# EAGLE design transmitter (EAGLE 9.1.2)
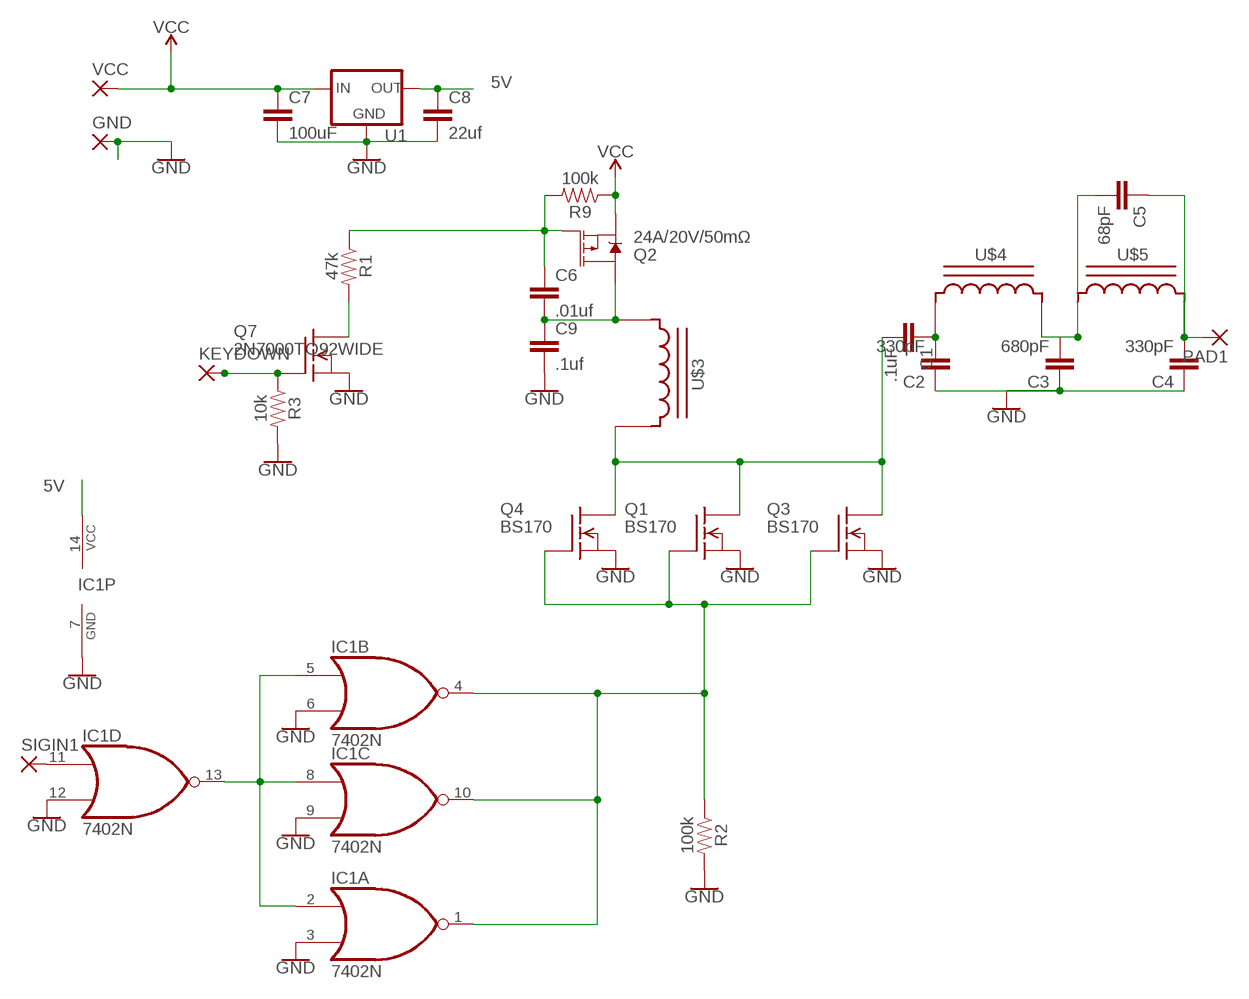
[diagram p0: schematic, sheet 1]

## Parts
C1  .1uF  C5/3.5  [C5B3.5]
C2  330pF  C5/3.5  [C5B3.5]
C3  680pF  C5/3.5  [C5B3.5]
C4  330pF  C5/3.5  [C5B3.5]
C5  68pF  C5/3.5  [C5B3.5]
C6  .01uf  C5/3.5  [C5B3.5]
C7  100uF  C5/3.5  [C5B3.5]
C8  22uf  C5/3.5  [C5B3.5]
C9  .1uf  C5/3.5  [C5B3.5]
GND  3,17/1,1  [3,17/1,1]
IC1  7402N  [DIL14]
KEYDOWN  3,17/1,1  [3,17/1,1]
PAD1  3,17/1,1  [3,17/1,1]
Q1  BS170  [TO92]
Q2  24A/20V/50mΩ  MOSFET_PCH-NDP6020P  [TO220V]
Q3  BS170  [TO92]
Q4  BS170  [TO92]
Q7  2N7000TO92WIDE  [TO92]
R1  47k  1KOHM-HORIZ-1/4W-1%  [AXIAL-0.3]
R2  100k  1KOHM-HORIZ-1/4W-1%  [AXIAL-0.3]
R3  10k  1KOHM-HORIZ-1/4W-1%  [AXIAL-0.3]
R9  100k  1KOHM-HORIZ-1/4W-1%  [AXIAL-0.3]
SIGIN1  3,17/1,1  [3,17/1,1]
U1  V_REG_78XXTO-92_UNTESTED  [TO-92]
U$3  T50_INDUCTOR  [T50_INDUCTOR]
U$4  T37_INDUCTOR  [T37_INDUCTOR]
U$5  T37_INDUCTOR  [T37_INDUCTOR]
VCC  3,17/1,1  [3,17/1,1]

## Nets
5V: C8.1 IC1.14(P:VCC) U1.1(OUT)
GND: C2.1 C3.1 C4.1 C7.2 C8.2 C9.2 GND.1(P) IC1.3(A:I1) IC1.6(B:I1) IC1.7(P:GND) IC1.9(C:I1) IC1.12(D:I1) Q1.1(S) Q3.1(S) Q4.1(S) Q7.1(S) R2.P$2 R3.P$2 U1.2(GND)
N$1: C1.1 C2.2 U$4.CB
N$2: C1.2 Q1.3(D) Q3.3(D) Q4.3(D) U$3.CA
N$3: C6.2 C9.1 Q2.2(D) U$3.CB
N$4: C6.1 Q2.1(G) R1.P$1 R9.P$2
N$5: Q7.3(D) R1.P$2
N$6: IC1.2(A:I0) IC1.5(B:I0) IC1.8(C:I0) IC1.13(D:O)
N$7: KEYDOWN.1(P) Q7.2(G) R3.P$1
N$8: IC1.1(A:O) IC1.4(B:O) IC1.10(C:O) Q1.2(G) Q3.2(G) Q4.2(G) R2.P$1
N$9: IC1.11(D:I0) SIGIN1.1(P)
N$10: C3.2 C5.2 U$4.CA U$5.CB
N$11: C4.2 C5.1 PAD1.1(P) U$5.CA
VCC: C7.1 Q2.3(S) R9.P$1 U1.3(IN) VCC.1(P)

## Library data of the parts
C1-C9 = capacitor-wima:C: CAPACITOR naming: grid - package width
GND KEYDOWN PAD1 SIGIN1 VCC = wirepad:3,17/1,1: THROUGH-HOLE PAD
IC1 = 74xx-us:74*02: Quad 2-input NOR gate
Q1 Q3 Q4 = transistor-fet+irf7201:BS170: N-Channel Enhancement MOSFET 200V; 0,16A; 11Ohm
Q2 = SparkFun-DiscreteSemi:MOSFET_PCH: P-channel MOSFETs Voltage controlled devices that allow control of high current outputs. SparkFun Products: SparkFun ESP32 Thing <https://www.sparkfun.com/products/13907> SparkFun ESP8266 Thing <https://www.sparkfun.com/products/13231>; PROD_ID: TRANS-13060
Q7 = transistor-fet+irf7201:2N7000: N-Channel Enhancement MOSFET 20V; 4A; 0,75Ohm
R1-R3 R9 = SparkFun-Resistors:1KOHM: 1kΩ resistor A resistor is a passive two-terminal electrical component that implements electrical resistance as a circuit element. Resistors act to reduce current flow, and, at the same time, act to lower voltage levels within circuits. - Wikipedia; PROD_ID: RES-12182; VALUE: 1k
U1 = SparkFun-IC-Power:V_REG_78XX: Voltage Regulator Standard 78xx regulator. IGO (Input Ground Output). Spark Fun Electronics SKU : COM-00107
U$3 = toroid:T50_INDUCTOR: Inductor wound on a T50 Core
U$4 U$5 = toroid:T37_INDUCTOR: Inductor wound on a T37 Toroid

## Net classes
0 default: width 0.762 mm, drill 0.762 mm, clearance 0.508 mm

## Board
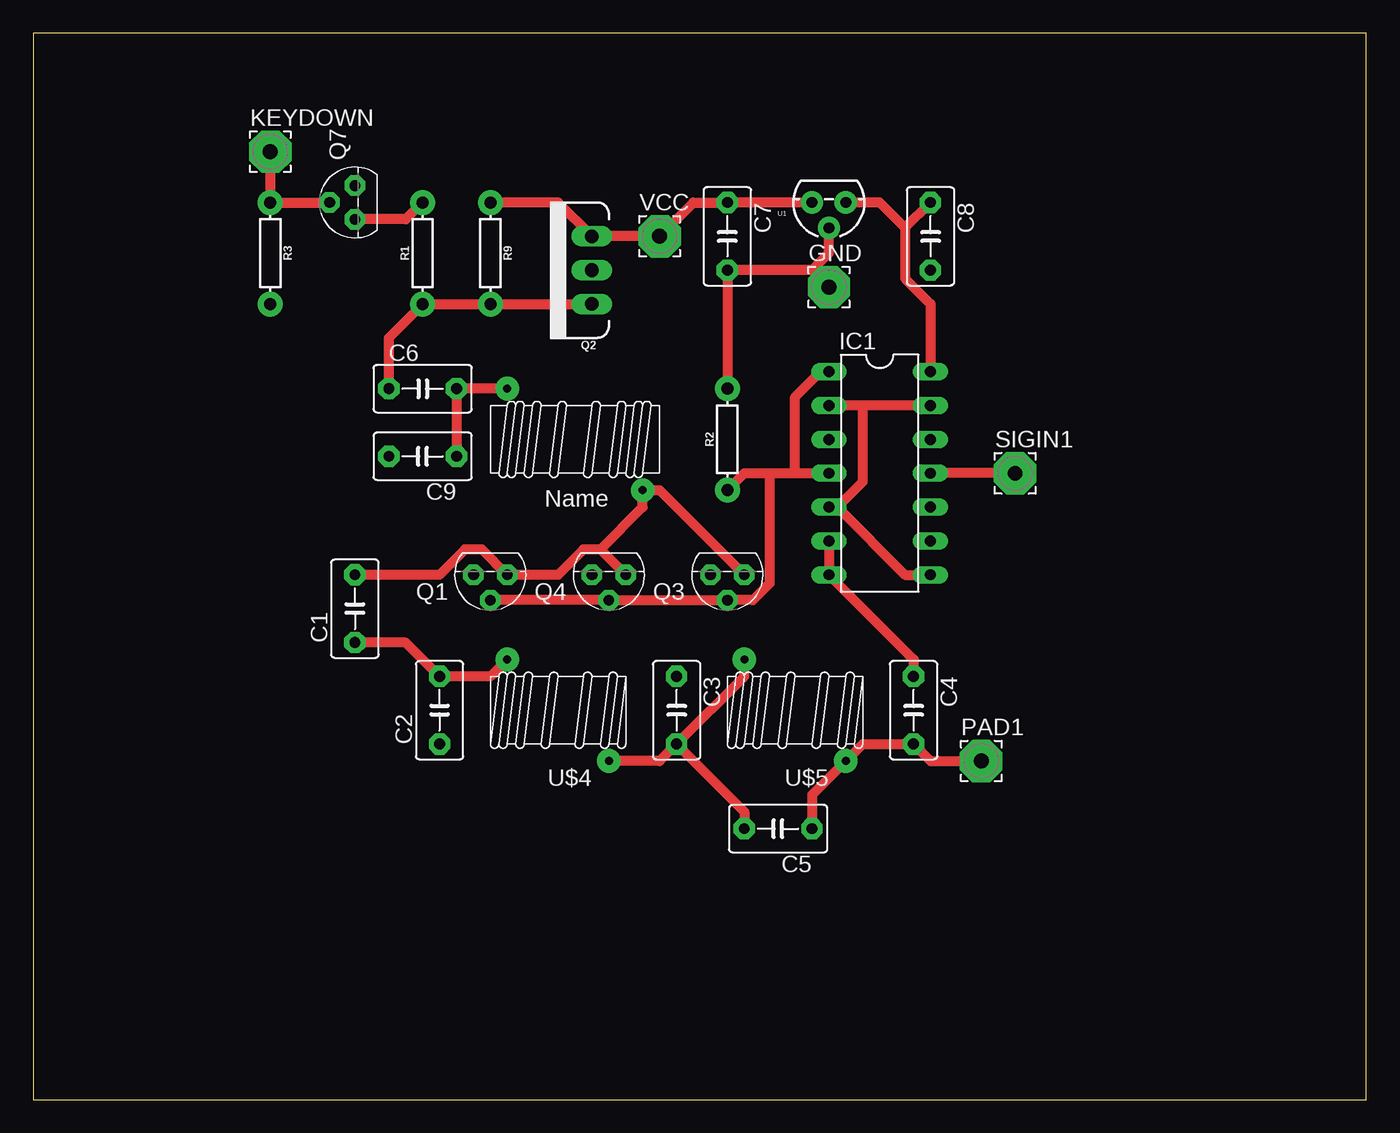
[diagram p1: board, top side]
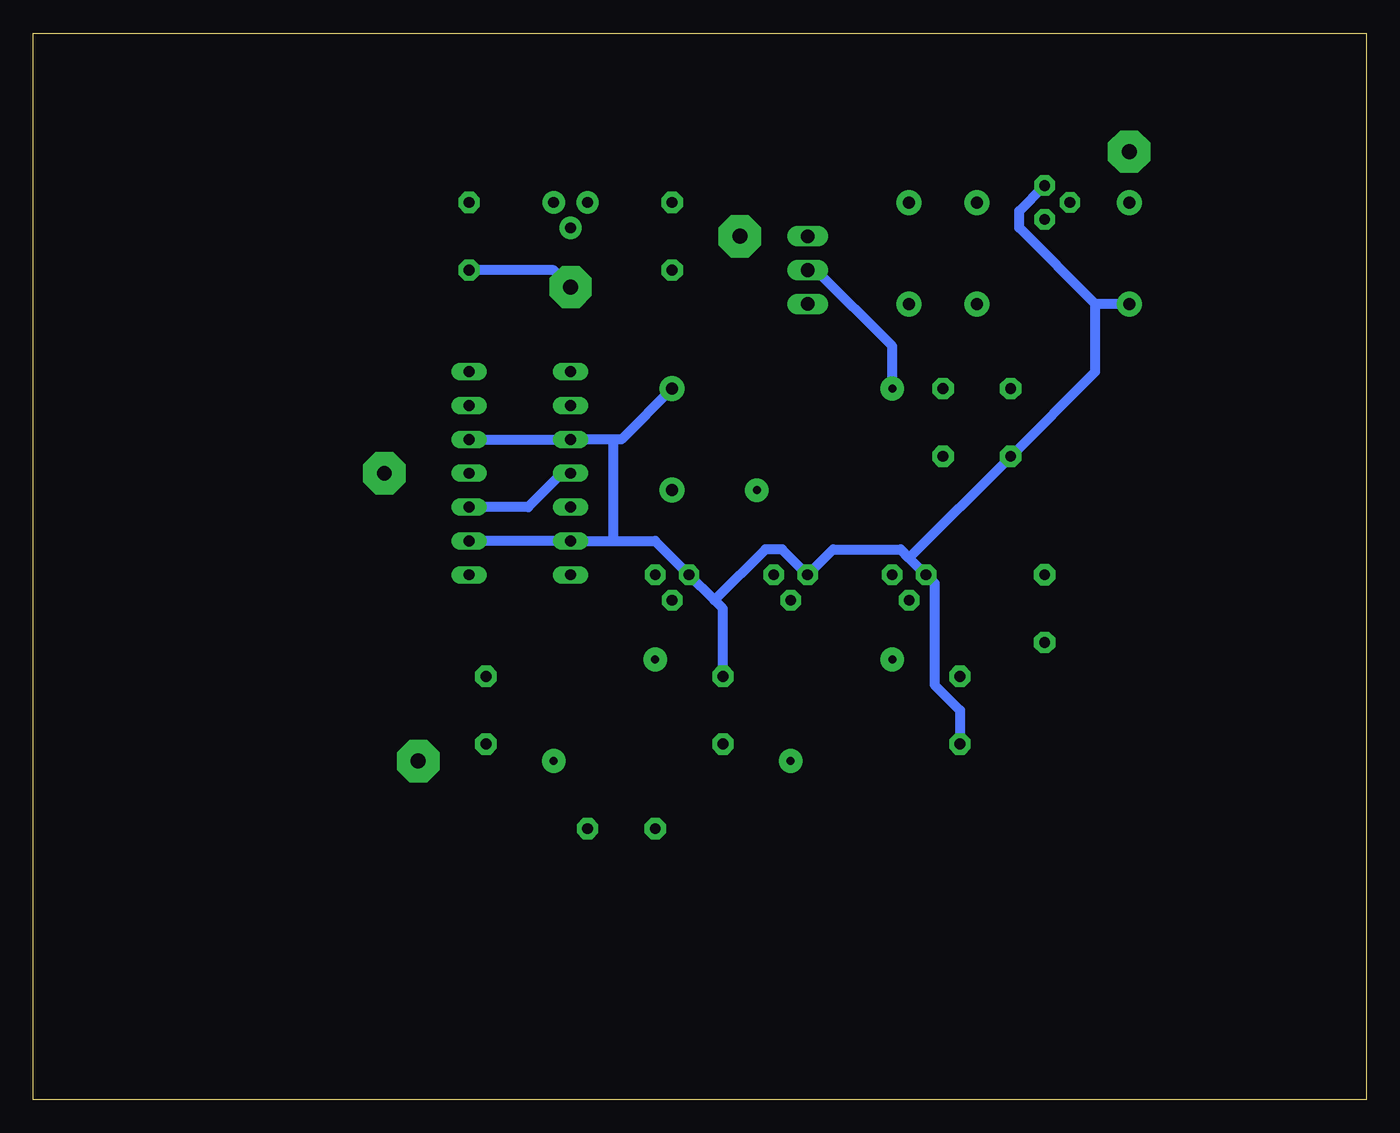
[diagram p2: board, bottom side, seen from below]

Size 100 x 80 mm. Coordinates in mm from the lower left corner, seen from the top.
Outline: 0,0 100,0 100,80 0,80 0,0
Copper layers (1*16): Top 0.035mm / dielectric 1.5mm / Bottom 0.035mm
Design rules "default": minimum track width 6mil, minimum drill 0.35mm, track to track 6mil, track to pad 6mil, pad to pad 6mil, via to via 6mil, smd to smd 6mil, copper to edge 40mil, drill to drill 6mil, minimum pad ring 10mil, minimum via ring 8mil, stop-mask expansion 4mil, vias tented up to drill 0mil, thermal gap 10mil

### Footprints (pad centres in the part's own frame; a part is rotated, then mirrored left to right if it is on the bottom)
C5B3.5 = drill 0.813 pad 1.6 octagon: 1 -2.54,0; 2 2.54,0
3,17/1,1 = drill 1.118 pad 3.175 octagon: 1 0,0
DIL14 = drill 0.813 long: 1 -7.62,-3.81; 2 -5.08,-3.81; 3 -2.54,-3.81; 4 0,-3.81; 5 2.54,-3.81; 6 5.08,-3.81; 7 7.62,-3.81; 8 7.62,3.81; 9 5.08,3.81; 10 2.54,3.81; 11 0,3.81; 12 -2.54,3.81; 13 -5.08,3.81; 14 -7.62,3.81
TO92 = drill 0.813 pad 1.524 octagon: 1 1.27,0; 2 0,1.905; 3 -1.27,0
TO220V = drill 1.016 long: 1 -2.54,0; 2 0,0; 3 2.54,0
AXIAL-0.3 = drill 0.9 pad 1.88: P$1 -3.81,0; P$2 3.81,0
TO-92 = drill 0.813 pad 1.676: 1 -1.27,0; 2 0,1.905; 3 1.27,0
T50_INDUCTOR = drill 0.6 pad 1.778: CA -3.81,-5.08; CB 3.81,5.08
T37_INDUCTOR = drill 0.6 pad 1.778: CA -3.81,-3.81; CB 3.81,3.81

### Placement (x,y rotation side)
C1  24.13,36.83 90 top
C2  30.48,29.21 90 top
C3  48.26,29.21 270 top
C4  66.04,29.21 270 top
C5  55.88,20.32 180 top
C6  29.21,53.34 0 top
C7  52.07,64.77 270 top
C8  67.31,64.77 270 top
C9  29.21,48.26 180 top
GND  59.69,60.96 0 top
IC1  63.5,46.99 270 top
KEYDOWN  17.78,71.12 0 top
PAD1  71.12,25.4 0 top
Q1  34.29,39.37 180 top
Q2  41.91,62.23 90 top
Q3  52.07,39.37 180 top
Q4  43.18,39.37 180 top
Q7  24.13,67.31 90 top
R1  29.21,63.5 90 top
R2  52.07,49.53 90 top
R3  17.78,63.5 270 top
R9  34.29,63.5 270 top
SIGIN1  73.66,46.99 0 top
U1  59.69,67.31 180 top
U$3  40.64,49.53 90 top
U$4  39.37,29.21 90 top
U$5  57.15,29.21 90 top
VCC  46.99,64.77 0 top

### Tracks (layer width: path | path; a pad name or v marks a point on that pad's centre or on a via)
5V
  Top 0.762: IC1.14 67.31,59.69 65.41,61.59 65.41,65.41 | C8.1 65.41,65.41 | U1.1 63.5,67.31 65.41,65.41
GND
  Top 0.762: IC1.6 IC1.7 66.04,33.02 C4.1 | 58.42,62.23 C7.2 R2.P$2 | GND.1 58.42,62.23 | U1.2 59.69,63.5 58.42,62.23
  Bottom 0.762: 48.9,37.47 48.26,36.83 C3.1 | 48.9,37.47 Q3.1 53.34,41.91 56.52,41.91 | IC1.9 IC1.6 56.52,41.91 | IC1.12 IC1.3 56.52,49.53 | C8.2 60.96,62.23 GND.1 | 56.52,49.53 55.88,49.53 R2.P$2 | 56.52,49.53 56.52,41.91 | Q7.1 26.04,66.67 26.04,65.41 20.32,59.69 | R3.P$2 20.32,59.69 | 34.29,40.64 34.92,41.27 40.01,41.27 Q4.1 43.81,41.27 45.09,41.27 48.9,37.47 | 34.29,40.64 Q1.1 32.38,38.73 32.38,31.11 30.48,29.21 C2.1 | 34.29,40.64 C9.2 20.32,54.61 20.32,59.69
N$1
  Top 0.762: U$4.CB 34.29,31.75 C2.2 27.94,34.29 C1.1
N$2
  Top 0.762: Q3.3 46.99,45.72 U$3.CA 45.72,44.45 42.55,41.27 | 42.55,41.27 41.27,41.27 39.37,39.37 Q1.3 33.66,41.27 32.38,41.27 30.48,39.37 C1.2 | Q4.3 42.55,41.27
N$3
  Top 0.762: C9.1 C6.2 U$3.CB
  Bottom 0.762: Q2.2 41.27,62.23 35.56,56.52 U$3.CB
N$4
  Top 0.762: Q2.1 R9.P$2 R1.P$1 26.67,57.15 C6.1
N$5
  Top 0.762: Q7.3 27.94,66.04 R1.P$2
N$6
  Top 0.762: IC1.13 62.23,52.07 | 62.23,52.07 IC1.2 | IC1.8 65.41,39.37 60.33,44.45 | 60.33,44.45 IC1.5 60.33,44.45 | 62.23,52.07 62.23,46.35 60.33,44.45
N$7
  Top 0.762: Q7.2 R3.P$1 KEYDOWN.1
N$8
  Top 0.762: Q1.2 Q4.2 Q3.2 53.98,37.47 55.24,38.73 55.24,46.99 | 55.24,46.99 53.34,46.99 R2.P$1 | 55.24,46.99 57.15,46.99 | 57.15,46.99 IC1.4 | IC1.1 59.05,54.61 57.15,52.7 57.15,46.99
  Bottom 0.762: IC1.10 62.87,44.45 60.33,46.99 IC1.4
N$9
  Top 0.762: SIGIN1.1 IC1.11
N$10
  Top 0.762: C5.2 53.34,21.59 C3.2 | U$4.CA 46.99,25.4 C3.2 | U$5.CB 53.34,31.75 C3.2
N$11
  Top 0.762: C5.1 58.42,22.86 U$5.CA 62.23,26.67 C4.2 67.31,25.4 PAD1.1
VCC
  Top 0.762: U1.3 C7.1 49.53,67.31 VCC.1 Q2.3 39.37,67.31 R9.P$1